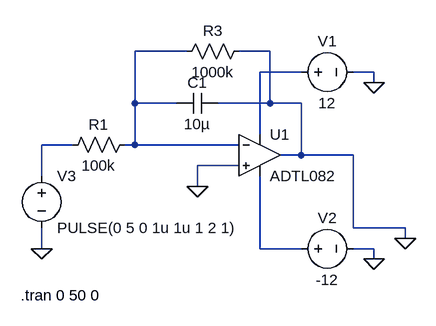
[diagram p0: schematic Circuito6.asc]
Circuito6.asc, the LTspice schematic file:
Version 4.1
SHEET 1 880 680
WIRE 192 32 112 32
WIRE 320 32 272 32
WIRE 368 64 304 64
WIRE 480 64 448 64
WIRE 480 80 480 64
WIRE 112 112 112 32
WIRE 176 112 112 112
WIRE 320 112 320 32
WIRE 320 112 240 112
WIRE 368 112 320 112
WIRE 304 160 304 64
WIRE 16 176 -32 176
WIRE 112 176 112 112
WIRE 112 176 96 176
WIRE 272 176 112 176
WIRE 368 192 368 112
WIRE 368 192 336 192
WIRE 448 192 368 192
WIRE 272 208 208 208
WIRE -32 224 -32 176
WIRE 208 240 208 208
WIRE 448 304 448 192
WIRE 528 304 448 304
WIRE 528 320 528 304
WIRE -32 336 -32 304
WIRE 304 336 304 224
WIRE 368 336 304 336
WIRE 480 336 448 336
WIRE 480 352 480 336
FLAG 480 80 0
FLAG 480 352 0
FLAG 208 240 0
FLAG -32 336 0
FLAG 528 320 0
SYMBOL res 112 160 R90
WINDOW 0 0 56 VBottom 2
WINDOW 3 32 56 VTop 2
SYMATTR InstName R1
SYMATTR Value 100k
SYMBOL cap 240 96 R90
WINDOW 0 0 32 VBottom 2
WINDOW 3 32 32 VTop 2
SYMATTR InstName C1
SYMATTR Value 10µ
SYMBOL OpAmps\\ADTL082 304 128 R0
SYMATTR InstName U1
SYMBOL voltage 352 64 R270
WINDOW 0 32 56 VTop 2
WINDOW 3 -32 56 VBottom 2
WINDOW 123 0 0 Left 0
WINDOW 39 0 0 Left 0
SYMATTR InstName V1
SYMATTR Value 12
SYMBOL voltage 352 336 R270
WINDOW 0 32 56 VTop 2
WINDOW 3 -32 56 VBottom 2
WINDOW 123 0 0 Left 0
WINDOW 39 0 0 Left 0
SYMATTR InstName V2
SYMATTR Value -12
SYMBOL voltage -32 208 R0
WINDOW 123 0 0 Left 0
WINDOW 39 0 0 Left 0
SYMATTR InstName V3
SYMATTR Value PULSE(0 5 0 1u 1u 1 2 1)
SYMBOL res 288 16 R90
WINDOW 0 0 56 VBottom 2
WINDOW 3 32 56 VTop 2
SYMATTR InstName R3
SYMATTR Value 1000k
TEXT -64 408 Left 2 !.tran 0 50 0

The netlist it stands for:
* Circuito6.asc
R1 N001 N003 100k
C1 0 N001 10µ
X§U1 0 N001 N002 N004 0 ADTL082  ; pins In+ In- V+ V- OUT
V1 N002 0 12
V2 N004 0 -12
V3 N003 0 PULSE(0 5 0 1u 1u 1 2 1)
R3 0 N001 1000k
.tran 0 50 0
.lib ADI.lib
.backanno
.end